# Altium schematic sheet RS485.SchDoc
size A4; DocumentNumber: 6; SheetNumber: 6; SheetTotal: 9
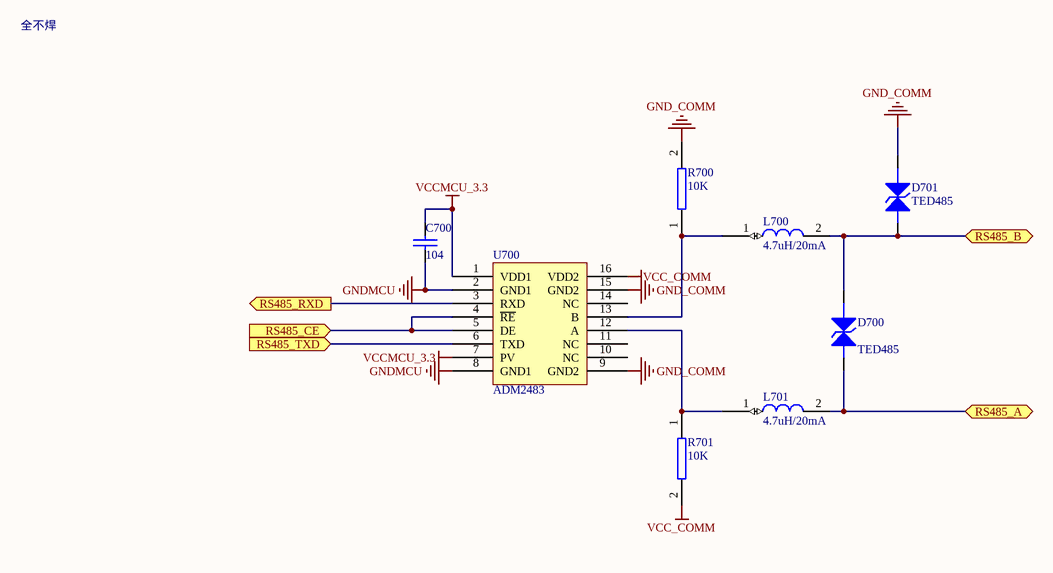
[diagram p0: RS485.SchDoc]

## Parts
C700  104  [0805/C2]
D700  TED485  [TED485]
D701  TED485  [TED485]
L700  4.7uH/20mA  [1210]
L701  4.7uH/20mA  [1210]
R700  10K  [0805/R2]
R701  10K  [0805/R2]
U700  ADM2483  [ADM2483-16]

## Ports
RS485_A (bidir), RS485_B (bidir), RS485_CE (in), RS485_RXD (out), RS485_TXD (in)

## Nets
GND_COMM: D701.2 R700.2 U700.9(GND2) U700.15(GND2)
GNDMCU: C700.1 U700.2(GND1) U700.8(GND1)
VCC_COMM: R701.2 U700.16(VDD2)
VCCMCU_3.3: C700.2 U700.1(VDD1) U700.7(PV)
RS485_A: D700.1 L701.2 ; port RS485_A
RS485_B: D700.2 D701.1 L700.2 ; port RS485_B
RS485_CE: U700.4(~{RE}) U700.5(DE) ; port RS485_CE
RS485_RXD: U700.3(RXD) ; port RS485_RXD
RS485_TXD: U700.6(TXD) ; port RS485_TXD
NetL700_1: L700.1 R700.1 U700.13(B)
NetL701_1: L701.1 R701.1 U700.12(A)

Not connected (* = marked no-connect by the designer): U700 10(NC) 11(NC) 14(NC)

## Notes on the sheet
- 全不焊
- Title
- Size:
- Date:
- A4
- Number:
- Time:
- Revision:
- Sheet
- of
- File:

## Library data of the parts
C700 = CAP: Capacitor
L700 L701 = FUSE
R700 R701 = RES2
U700 = RSM485CHT